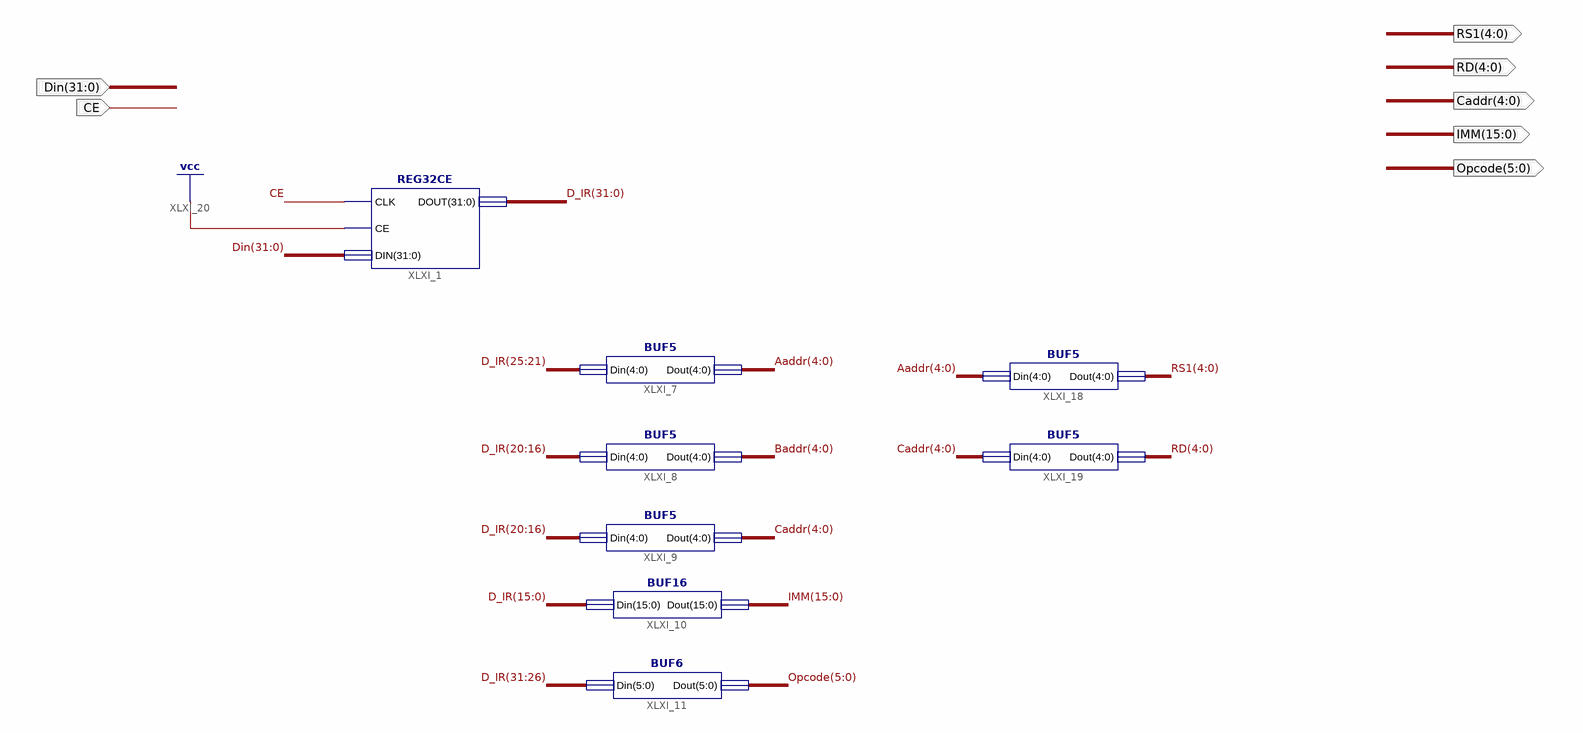
[diagram p0: schematic sheet 1]
// Xilinx ISE schematic IR.sch (spartan6) as structural Verilog: 8 symbols, 9 ports
module IR (
  input  [31:0] Din,
  input  CE,
  output [4:0] Aaddr,
  output [4:0] Caddr,
  output [4:0] Baddr,
  output [4:0] RS1,
  output [4:0] RD,
  output [5:0] Opcode,
  output [15:0] IMM
);

  wire [31:0] D_IR;

  REG32CE XLXI_1 (.CLK(CE), .CE(1'b1), .DIN(Din), .DOUT(D_IR));
  BUF5 XLXI_7 (.Din(D_IR[25:21]), .Dout(Aaddr));
  BUF5 XLXI_8 (.Din(D_IR[20:16]), .Dout(Baddr));
  BUF5 XLXI_9 (.Din(D_IR[20:16]), .Dout(Caddr));
  BUF16 XLXI_10 (.Din(D_IR[15:0]), .Dout(IMM));
  BUF6 XLXI_11 (.Din(D_IR[31:26]), .Dout(Opcode));
  BUF5 XLXI_18 (.Din(Aaddr), .Dout(RS1));
  BUF5 XLXI_19 (.Din(Caddr), .Dout(RD));
endmodule
